# EAGLE design equaliser_TDA7418 (EAGLE 6.3)
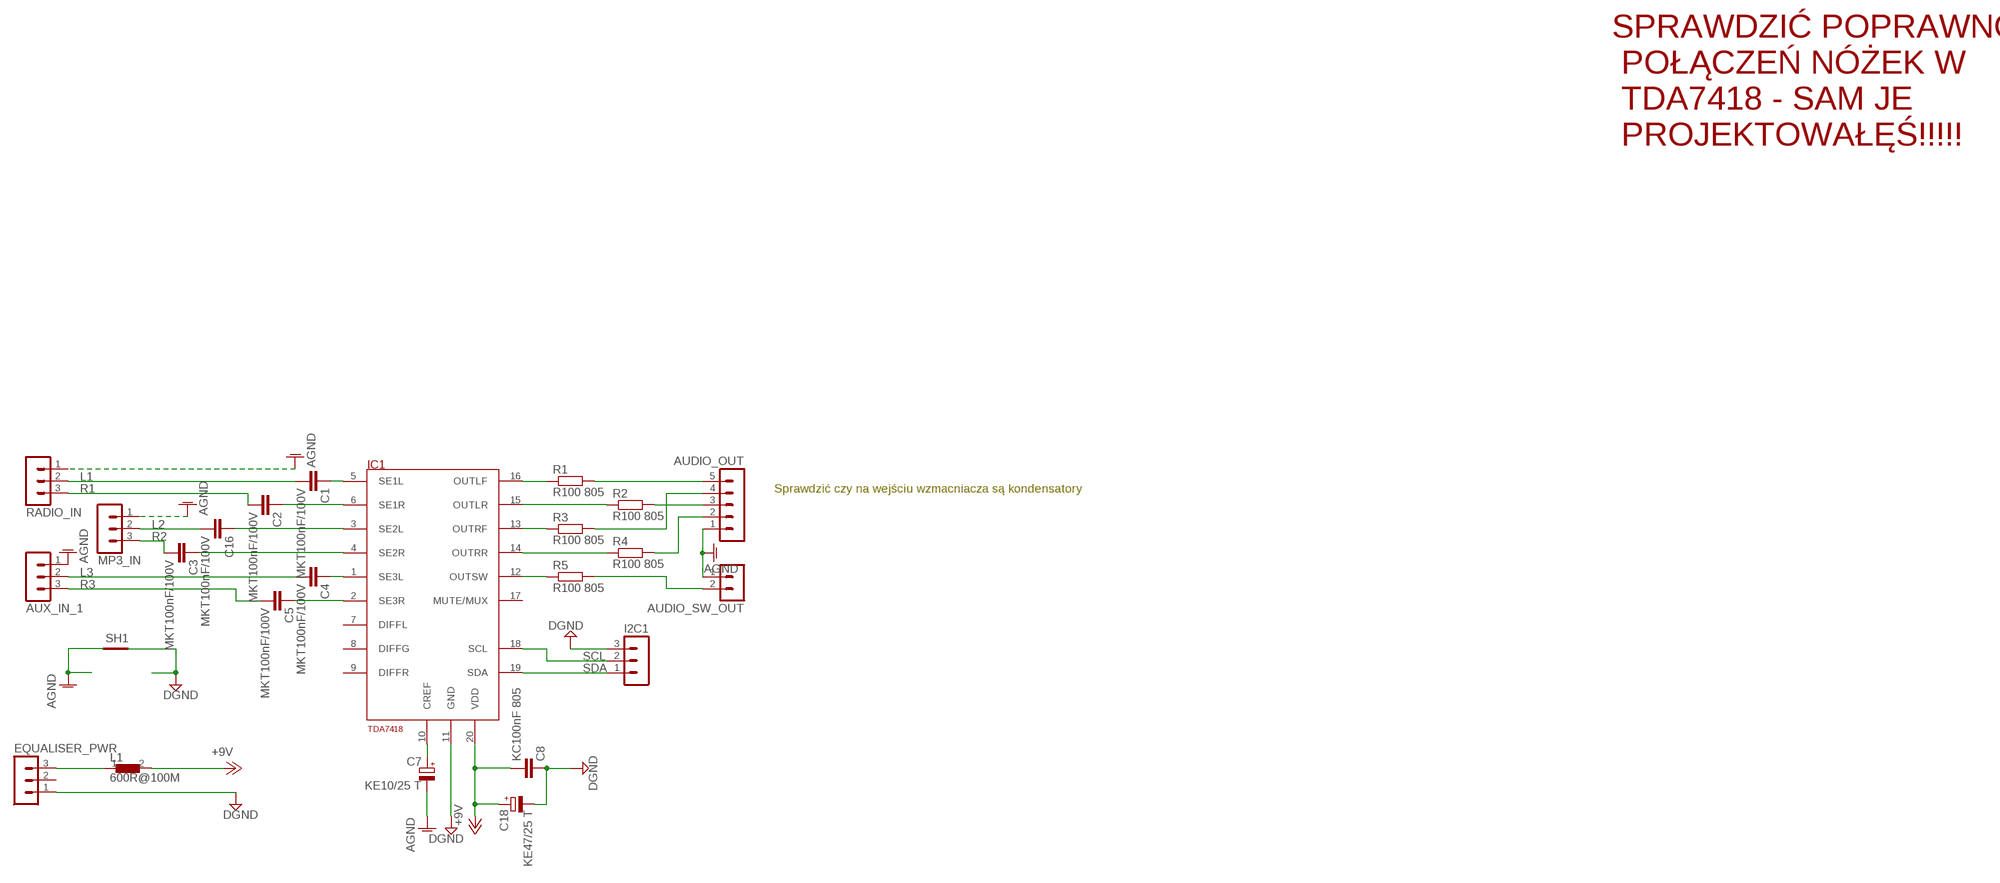
[diagram p0: schematic, sheet 1]

## Parts
AUDIO_OUT  MA05-1  [MA05-1]
AUDIO_SW_OUT  MA02-1  [MA02-1]
AUX_IN_1  MA03-1  [MA03-1]
C1  MKT100nF/100V  C-EU050-035X075  [C050-035X075]
C2  MKT100nF/100V  C-EU050-035X075  [C050-035X075]
C3  MKT100nF/100V  C-EU050-035X075  [C050-035X075]
C4  MKT100nF/100V  C-EU050-035X075  [C050-035X075]
C5  MKT100nF/100V  C-EU050-035X075  [C050-035X075]
C7  KE10/25 T  CPOL-EUE1.8-4  [E1,8-4]
C8  KC100nF 805  C-EUC0805  [C0805]
C16  MKT100nF/100V  C-EU050-035X075  [C050-035X075]
C18  KE47/25 T  CPOL-EUB45181B  [B45181B]
EQUALISER_PWR  MA03-1  [MA03-1]
I2C1  MA03-1  [MA03-1]
IC1  TDA7418  [SO20]
L1  600R@100M  FERRITR0805  [R0805]
MP3_IN  MA03-1  [MA03-1]
R1  R100 805  R-EU_0204/2V  [0204V]
R2  R100 805  R-EU_0204/2V  [0204V]
R3  R100 805  R-EU_0204/5  [0204/5]
R4  R100 805  R-EU_0204/2V  [0204V]
R5  R100 805  R-EU_0204/2V  [0204V]
RADIO_IN  MA03-1  [MA03-1]
SH1  SHORT-HT5  [SHORT_TOP-50]

## Nets
+12V: C8.2 C18.+ IC1.20(VDD) L1.2 ; supply symbol labelled +9V
AGND: AUDIO_OUT.1 AUDIO_SW_OUT.1 AUX_IN_1.1 C7.- MP3_IN.1 RADIO_IN.1 SH1.1
DGND: C8.1 C18.- EQUALISER_PWR.1 I2C1.3 IC1.11(GND) SH1.2
L1: C1.2 RADIO_IN.2
L2: C16.2 MP3_IN.2
L3: AUX_IN_1.2 C4.2
N$1: EQUALISER_PWR.3 L1.1
N$2: AUDIO_SW_OUT.2 R5.2
N$3: C7.+ IC1.10(CREF)
N$4: C1.1 IC1.5(SE1L)
N$5: C2.1 IC1.6(SE1R)
N$6: C16.1 IC1.3(SE2L)
N$7: C3.1 IC1.4(SE2R)
N$8: C4.1 IC1.1(SE3L)
N$9: C5.1 IC1.2(SE3R)
N$12: IC1.16(OUTLF) R1.1
N$13: IC1.15(OUTLR) R2.1
N$14: AUDIO_OUT.4 R3.2
N$15: AUDIO_OUT.3 R2.2
N$16: IC1.13(OUTRF) R3.1
N$17: AUDIO_OUT.2 R4.2
N$18: IC1.14(OUTRR) R4.1
N$19: IC1.12(OUTSW) R5.1
N$25: AUDIO_OUT.5 R1.2
R1: C2.2 RADIO_IN.3
R2: C3.2 MP3_IN.3
R3: AUX_IN_1.3 C5.2
SCL: I2C1.2 IC1.18(SCL)
SDA: I2C1.1 IC1.19(SDA)
Unconnected: EQUALISER_PWR.2 IC1.7(DIFFL) IC1.8(DIFFG) IC1.9(DIFFR) IC1.17(MUTE/MUX)

## Notes on the sheet
- SPRAWDZIĆ POPRAWNOŚć
   POŁĄCZEŃ NÓŻEK W
   TDA7418 - SAM JE
   PROJEKTOWAŁĘŚ!!!!!
- Sprawdzić czy na wejściu wzmacniacza są kondensatory

## Library data of the parts
AUDIO_OUT = con-lstb:MA05-1: PIN HEADER; OC_FARNELL: unknown; OC_NEWARK: unknown
AUDIO_SW_OUT = con-lstb_SileliS:MA02-1: PIN HEADER
AUX_IN_1 EQUALISER_PWR I2C1 MP3_IN RADIO_IN = con-lstb:MA03-1: PIN HEADER; OC_FARNELL: unknown; OC_NEWARK: unknown
C1-C5 C8 C16 = rcl:C-EU: CAPACITOR, European symbol
C7 = resistor:CPOL-EU: POLARIZED CAPACITOR, European symbol
C18 = rcl:CPOL-EU: POLARIZED CAPACITOR, European symbol
IC1 = TDA7318_DIP:TDA7418; PACKAGE: SO20
L1 = ferrit_bear:FERRIT
R1-R5 = resistor:R-EU_: RESISTOR, European symbol
SH1 = shorts-old:SHORT-H: Short between two nets; BOM: no

## Board
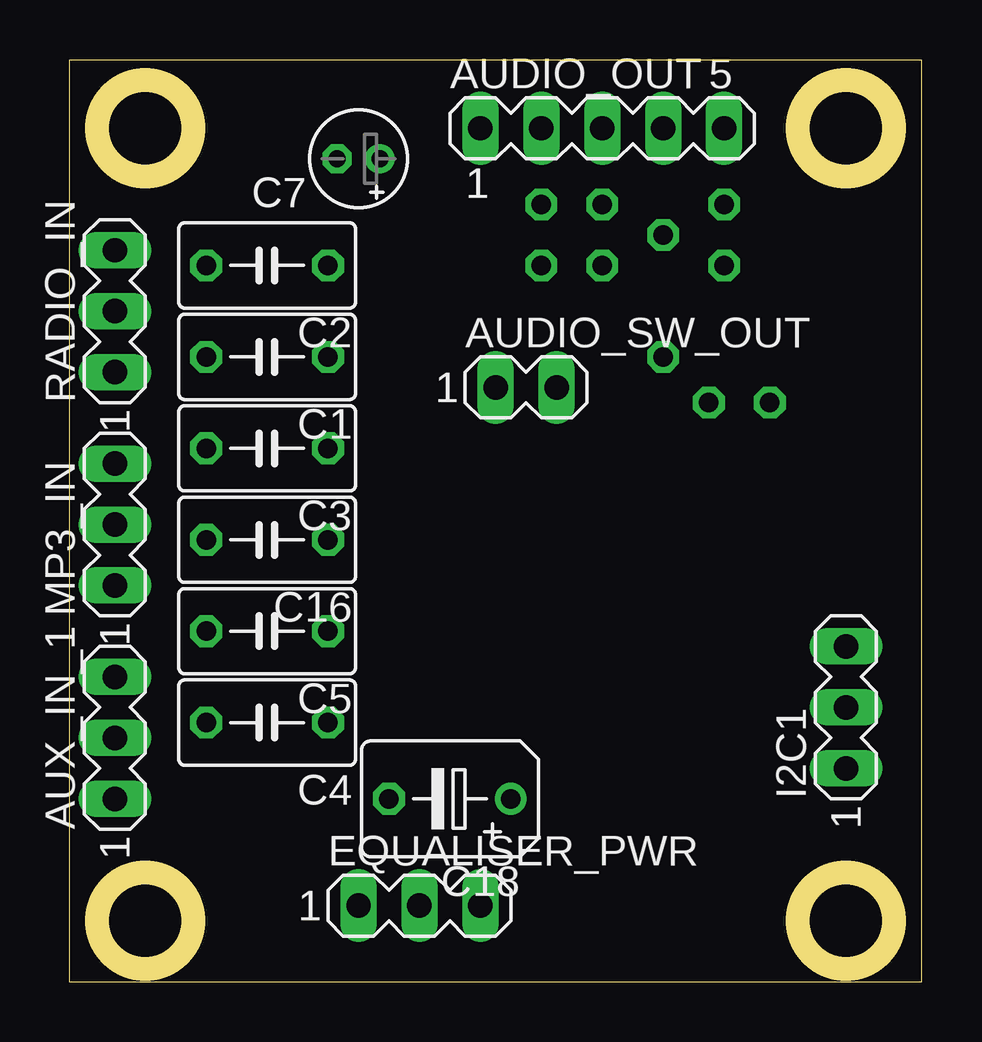
[diagram p1: board, top side]
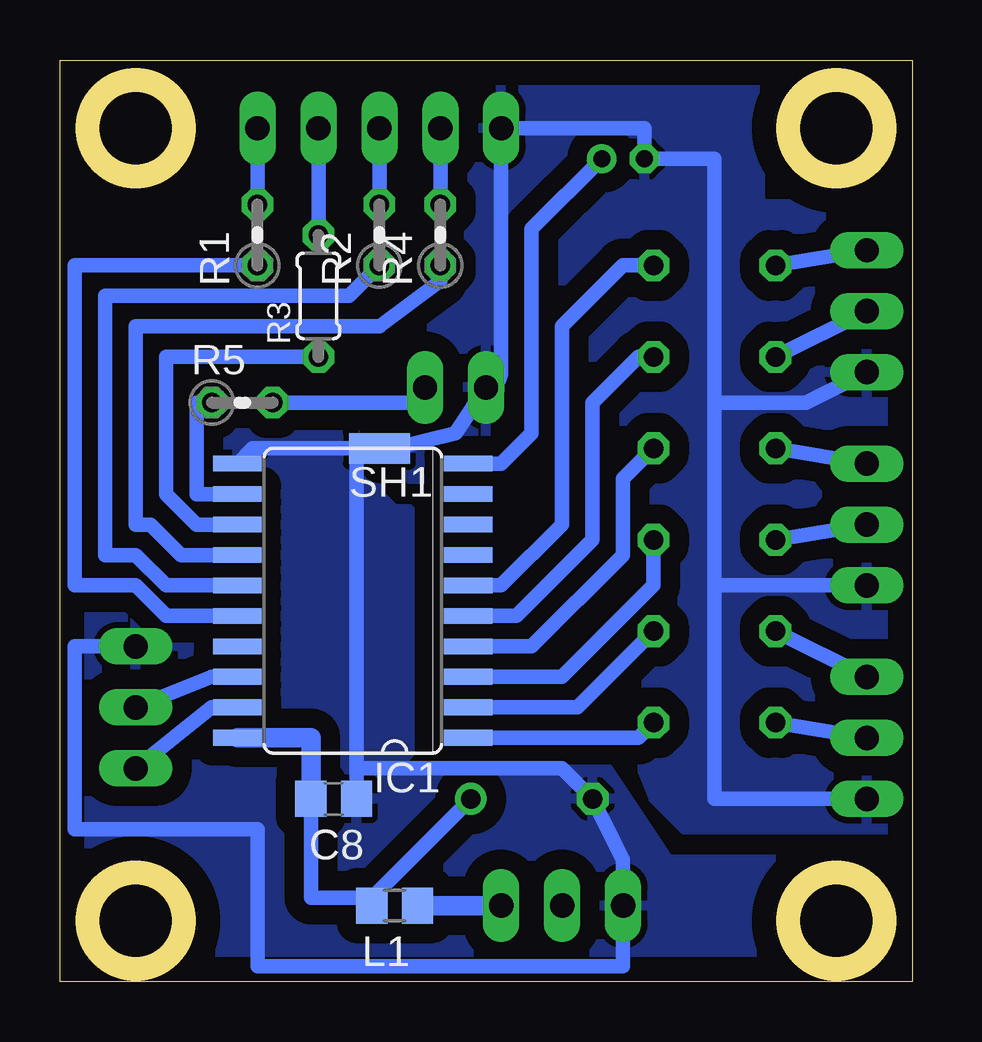
[diagram p2: board, bottom side, seen from below]

Size 35.54 x 38.41 mm. Coordinates in mm from the lower left corner, seen from the top.
Outline: 0,0 35.54,0 35.54,38.41 0,38.41 0,0
Outline: circle at 3.18,35.56 radius 2
Outline: circle at 32.39,35.56 radius 2
Outline: circle at 32.39,2.54 radius 2
Outline: circle at 3.18,2.54 radius 2
Copper layers (1*16): Top 0.035mm / dielectric 1.5mm / Bottom 0.035mm
Design rules "default": minimum track width 10mil, minimum drill 24mil, track to track 8mil, track to pad 8mil, pad to pad 8mil, via to via 8mil, smd to smd 8mil, copper to edge 40mil, drill to drill 8mil, minimum pad ring 10mil, minimum via ring 8mil, stop-mask expansion 4mil, vias tented up to drill 0mil, thermal gap 10mil

### Footprints (pad centres in the part's own frame; a part is rotated, then mirrored left to right if it is on the bottom)
MA05-1 = drill 1.016 long: 1 -5.08,0; 2 -2.54,0; 3 0,0; 4 2.54,0; 5 5.08,0
MA02-1 = drill 1.016 long: 1 -2.54,0; 2 0,0
MA03-1 = drill 1.016 long: 1 -2.54,0; 2 0,0; 3 2.54,0
C050-035X075 = drill 0.813 octagon: 1 -2.54,0; 2 2.54,0
E1,8-4 = drill 0.711 pad 1.168: + -0.889,0 | drill 0.711 pad 1.168 octagon: - 0.889,0
C0805 = smd 1.3 x 1.5: 1 -0.95,0; 2 0.95,0
B45181B = drill 0.813: + -2.54,0 | drill 0.813 octagon: - 2.54,0
SO20 = smd 0.66 x 2.032: 1 -4.445,-3.073; 2 -3.175,-3.073; 3 -1.905,-3.073; 4 -0.635,-3.073; 5 0.635,-3.073; 6 1.905,-3.073; 7 3.175,-3.073; 8 4.445,-3.073; 9 5.715,-3.073; 10 6.985,-3.073; 11 6.985,6.553; 12 5.715,6.553; 13 4.445,6.553; 14 3.175,6.553; 15 1.905,6.553; 16 0.635,6.553; 17 -0.635,6.553; 18 -1.905,6.553; 19 -3.175,6.553; 20 -4.445,6.553
R0805 = smd 1.3 x 1.5: 1 -0.95,0; 2 0.95,0
0204V = drill 0.813 octagon: 1 -1.27,0; 2 1.27,0
0204/5 = drill 0.813 octagon: 1 -2.54,0; 2 2.54,0
SHORT_TOP-50 = smd 1.27 x 1.27: 1 0.635,0; 2 -0.635,0

### Placement (x,y rotation side)
AUDIO_OUT  22.23,35.56 0 top
AUDIO_SW_OUT  20.32,24.77 0 top
AUX_IN_1  1.91,10.16 90 top
C1  8.26,26.03 180 top
C2  8.26,29.84 180 top
C3  8.26,22.22 180 top
C4  8.26,10.79 180 top
C5  8.26,14.61 180 top
C7  12.07,34.29 180 top
C8  24.13,7.62 180 bottom
C16  8.26,18.41 180 top
C18  15.88,7.62 180 top
EQUALISER_PWR  14.61,3.17 0 top
I2C1  32.39,11.43 90 top
IC1  21.59,14.61 90 bottom
L1  21.59,3.17 180 bottom
MP3_IN  1.91,19.05 90 top
R1  27.3,31.12 90 bottom
R2  22.23,31.12 90 bottom
R3  24.77,28.58 90 bottom
R4  19.69,31.12 90 bottom
R5  27.94,24.13 0 bottom
RADIO_IN  1.91,27.94 90 top
SH1  22.23,22.22 0 bottom

### Tracks (layer width: path | path; a pad name or v marks a point on that pad's centre or on a via)
+12V
  Bottom 0.61: C18.+ 22.54,3.49 | 22.54,3.49 L1.2 | 22.54,3.49 25.08,3.49 C8.2
  Bottom 0.813: IC1.20 25.08,10.16 C8.2
AGND
  Bottom 0.61: SH1.1 19.05,22.86 AUDIO_SW_OUT.1 arc-90 17.14,25.4 AUDIO_OUT.1 11.18,35.56 C7.- 8.26,34.29 8.26,24.13 | 8.26,24.13 8.26,16.51 | 8.26,16.51 8.26,7.62 AUX_IN_1.1 | MP3_IN.1 8.26,16.51 | RADIO_IN.1 4.45,24.13 8.26,24.13
  pour Bottom (isolate 0.813): 0.64,6.35 0.64,32.38 6.35,32.38 6.35,39.37 29.21,39.37 29.21,31.12 36.83,31.12 36.83,16.51 30.48,16.51 30.48,23.49 20.96,23.49 20.96,20.95 15.88,20.95 15.88,10.79 12.07,10.79 10.79,7.62 9.53,6.35
DGND
  Bottom 0.61: IC1.11 27.51,22.22 SH1.2 23.18,21.91 23.18,8.89 | 23.18,8.89 C8.1 | 23.18,8.89 14.61,8.89 C18.- 12.07,5.08 EQUALISER_PWR.1 12.07,0.63 27.3,0.63 27.3,6.35 34.92,6.35 34.92,13.97 I2C1.3
  pour Bottom (isolate 0.813): 5.71,-1.27 5.71,5.08 10.16,5.08 12.7,8.89 21.59,8.89 20.96,9.52 20.96,19.68 21.59,19.68 22.23,20.32 22.23,22.86 29.21,22.86 29.21,15.88 29.84,15.24 36.83,15.24 36.83,-1.27
L1
  Bottom 0.61: RADIO_IN.2 C1.2
L2
  Bottom 0.61: C16.2 MP3_IN.2
L3
  Bottom 0.61: C4.2 AUX_IN_1.2
N$1
  Bottom 0.813: EQUALISER_PWR.3 L1.1
N$2
  Bottom 0.61: AUDIO_SW_OUT.2 20.96,24.13 R5.2
N$3
  Bottom 0.61: C7.+ 15.88,31.37 15.88,22.86 17.14,21.59 IC1.10
N$4
  Bottom 0.61: C1.1 11.43,26.03 13.34,24.13 13.34,18.41 16.51,15.24 IC1.5
N$5
  Bottom 0.61: IC1.6 17.14,16.51 14.61,19.05 14.61,27.3 12.07,29.84 C2.1
N$6
  Bottom 0.61: C16.1 10.79,16.51 14.61,12.7 IC1.3
N$7
  Bottom 0.61: IC1.4 15.88,13.97 12.07,17.78 12.07,20.95 C3.1
N$8
  Bottom 0.61: C4.1 11.43,10.16 IC1.1
N$9
  Bottom 0.61: C5.1 13.97,11.43 IC1.2
N$12
  Bottom 0.61: R1.1 34.92,29.84 34.92,16.51 32.39,16.51 31.12,15.24 IC1.16
N$13
  Bottom 0.61: R2.1 23.5,28.58 33.66,28.58 33.66,17.78 32.39,17.78 31.12,16.51 IC1.15
N$14
  Bottom 0.61: R3.2 AUDIO_OUT.4
N$15
  Bottom 0.61: R2.2 AUDIO_OUT.3
N$16
  Bottom 0.61: R3.1 31.12,26.03 31.12,20.32 29.84,19.05 IC1.13
N$17
  Bottom 0.61: R4.2 AUDIO_OUT.2
N$18
  Bottom 0.61: R4.1 19.69,29.21 22.23,27.3 32.39,27.3 32.39,19.05 31.75,19.05 30.48,17.78 IC1.14
N$19
  Bottom 0.61: IC1.12 29.84,20.32 29.84,24.13 R5.1
N$25
  Bottom 0.61: R1.2 AUDIO_OUT.5
R1
  Bottom 0.61: RADIO_IN.3 C2.2
R2
  Bottom 0.61: C3.2 MP3_IN.3
R3
  Bottom 0.61: C5.2 AUX_IN_1.3
SCL
  Bottom 0.61: IC1.18 29.21,12.7 I2C1.2
SDA
  Bottom 0.61: IC1.19 29.21,11.43 I2C1.1

### Text on the board
Document: GND / SCL / SDA
Descript: Sprawdzić czy na wejściu wzmacniacza są kondensatory